# EAGLE design ESP32_4_RELAY_AND_LORA (EAGLE 9.6.2)
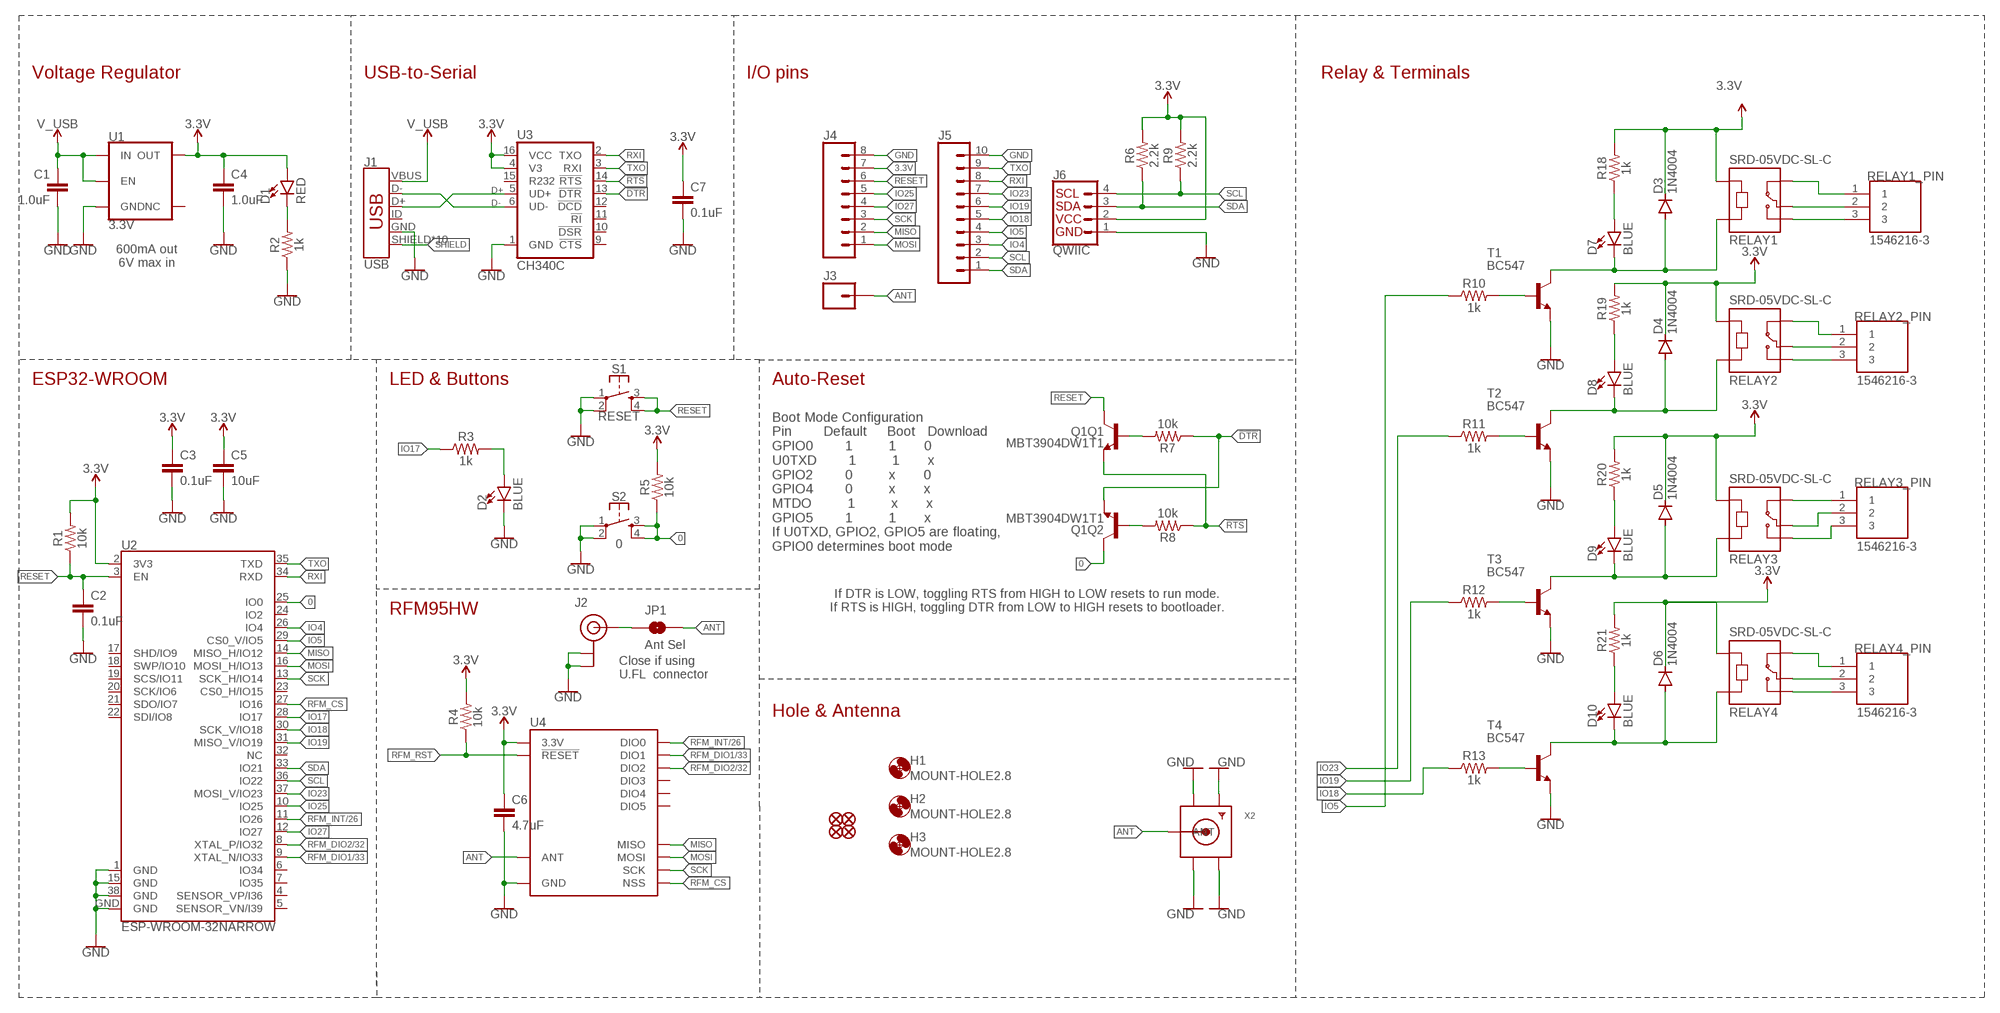
[diagram p0: schematic, sheet 1]

## Parts
C1  1.0uF  1.0UF-0603-16V-10%  [0603]
C2  0.1uF  0.1UF-0603-25V-(+80/-20%)  [0603]
C3  0.1uF  0.1UF-0603-25V-(+80/-20%)  [0603]
C4  1.0uF  1.0UF-0603-16V-10%  [0603]
C5  10uF  10UF-0603-6.3V-20%  [0603]
C6  4.7uF  4.7UF-0603-6.3V-(10%)  [0603]
C7  0.1uF  0.1UF-0603-25V-5%  [0603]
D1  RED  LED-RED0603  [LED-0603]
D2  BLUE  LED-BLUE0603  [LED-0603]
D3  1N4004  [DO41-10]
D4  1N4004  [DO41-10]
D5  1N4004  [DO41-10]
D6  1N4004  [DO41-10]
D7  BLUE  LED-BLUE0603  [LED-0603]
D8  BLUE  LED-BLUE0603  [LED-0603]
D9  BLUE  LED-BLUE0603  [LED-0603]
D10  BLUE  LED-BLUE0603  [LED-0603]
FD1  FIDUCIAL1X2  [FIDUCIAL-1X2]
FD2  FIDUCIAL1X2  [FIDUCIAL-1X2]
FD3  FIDUCIAL1X2  [FIDUCIAL-1X2]
FD4  FIDUCIAL1X2  [FIDUCIAL-1X2]
H1  MOUNT-HOLE2.8  [2,8]
H2  MOUNT-HOLE2.8  [2,8]
H3  MOUNT-HOLE2.8  [2,8]
J1  USB  USB_MICRO-B_HALF_PTH_MILL  [USB-MICROB-PTH-MILL]
J2  U.FL  [U.FL]
J3  CONN_01PTH_NO_SILK_YES_STOP  [1X01_NO_SILK]
J4  CONN_08NO_SILK_FEMALE_PTH  [1X08_NO_SILK]
J5  CONN_10NO_SILK_PTH_FEMALE  [1X10_NO_SILK]
J6  QWIIC  QWIIC_CONNECTORJS-1MM  [1X04_1MM_RA]
JP1  Ant Sel  JUMPER-SMT_2_NO_NO-SILK  [SMT-JUMPER_2_NO_NO-SILK]
Q1  MBT3904DW1T1  TRANS_NPN_DUAL-MBT3904DW1T1  [SC70-6]
R1  10k  10KOHM-0603-1/10W-1%  [0603]
R2  1k  1KOHM-0603-1/10W-1%  [0603]
R3  1k  1KOHM-0603-1/10W-1%  [0603]
R4  10k  10KOHM-0603-1/10W-1%  [0603]
R5  10k  10KOHM-0603-1/10W-1%  [0603]
R6  2.2k  2.2KOHM-0603-1/10W-1%  [0603]
R7  10k  10KOHM-0603-1/10W-1%  [0603]
R8  10k  10KOHM-0603-1/10W-1%  [0603]
R9  2.2k  2.2KOHM-0603-1/10W-1%  [0603]
R10  1k  1KOHM-0603-1/10W-1%  [0603]
R11  1k  1KOHM-0603-1/10W-1%  [0603]
R12  1k  1KOHM-0603-1/10W-1%  [0603]
R13  1k  1KOHM-0603-1/10W-1%  [0603]
R18  1k  1KOHM-0603-1/10W-1%  [0603]
R19  1k  1KOHM-0603-1/10W-1%  [0603]
R20  1k  1KOHM-0603-1/10W-1%  [0603]
R21  1k  1KOHM-0603-1/10W-1%  [0603]
RELAY1  SRD-05VDC-SL-C  [RELAY_SRD-05VDC-SL-C]
RELAY1_PIN  1546216-3  [TE_1546216-3]
RELAY2  SRD-05VDC-SL-C  [RELAY_SRD-05VDC-SL-C]
RELAY2_PIN  1546216-3  [TE_1546216-3]
RELAY3  SRD-05VDC-SL-C  [RELAY_SRD-05VDC-SL-C]
RELAY3_PIN  1546216-3  [TE_1546216-3]
RELAY4  SRD-05VDC-SL-C  [RELAY_SRD-05VDC-SL-C]
RELAY4_PIN  1546216-3  [TE_1546216-3]
S1  RESET  MOMENTARY-SWITCH-SPST-2-SMD-4.6X2.8MM  [TACTILE_SWITCH_SMD_4.6X2.8MM]
S2  0  MOMENTARY-SWITCH-SPST-2-SMD-4.6X2.8MM  [TACTILE_SWITCH_SMD_4.6X2.8MM]
T1  BC547  [TO92]
T2  BC547  [TO92]
T3  BC547  [TO92]
T4  BC547  [TO92]
U1  3.3V  V_REG_AP2112K-3.3V  [SOT23-5]
U2  ESP-WROOM-32NARROW  [ESP-WROOM-32-NARROW]
U3  CH340C  [SO016]
U4  RFM95W  [RFM95/96/97/98W]
X2  SMACONNECTOR_EDGE_UFL  [SMA_EDGELAUNCH_UFL]

## Nets
0: Q1.6(Q2:C) R5.1 S2.3 S2.4 U2.25(IO0)
3.3V: C3.1 C4.1 C5.1 C6.1 C7.1 D1.A J4.7 J6.2 R1.2 R4.2 R5.2 R6.2 R9.2 U1.5(OUT) U2.2(3V3) U3.4(V3) U3.16(VCC) U4.3.3V
!DTR: Q1.1(Q2:E) R7.1 U3.13(!DTR)
!RTS: Q1.4(Q1:E) R8.1 U3.14(!RTS)
ANT: J3.1 JP1.2 U4.ANT X2.P(ANT)
D+: J1.D+ U3.5(UD+)
D-: J1.D- U3.6(UD-)
GND: C1.2 C2.2 C3.2 C4.2 C5.2 C6.2 C7.2 D2.C J1.GND J2.1(GND) J2.2(GND) J4.8 J5.10 J6.1 R2.1 S1.1 S1.2 S2.1 S2.2 T1.1(E) T2.1(E) T3.1(E) T4.1(E) U1.2(GND) U2.1(GND) U2.15(GND) U2.38(GND) U2.GND U3.1(GND) U4.GND@1(GND) U4.GND@2(GND) U4.GND@3(GND)
GND.2: X2.GND@1(GND1) X2.GND@2(GND2) X2.GND@3(GND3) X2.GND@4(GND4) ; supply symbol labelled GND
IO4: J5.3 U2.26(IO4)
IO5: J5.4 R10.1 U2.29(CS0_V/IO5)
IO17: R3.1 U2.28(IO17)
IO18: J5.5 R13.1 U2.30(SCK_V/IO18)
IO19: J5.6 R12.1 U2.31(MISO_V/IO19)
IO23: J5.7 R11.1 U2.37(MOSI_V/IO23)
IO25: J4.5 U2.10(IO25)
IO27: J4.4 U2.12(IO27)
MISO: J4.2 U2.14(MISO_H/IO12) U4.MISO
MOSI: J4.1 U2.16(MOSI_H/IO13) U4.MOSI
N$1: D1.C R2.2
N$2: D2.A R3.2
N$3: J2.FEED(SIGNAL) JP1.1
N$4: RELAY2.NC RELAY2_PIN.1
N$5: RELAY2.COM RELAY2_PIN.2
N$6: RELAY2.NO RELAY2_PIN.3
N$7: RELAY3.NC RELAY3_PIN.1
N$8: RELAY3.COM RELAY3_PIN.2
N$9: RELAY3.NO RELAY3_PIN.3
N$10: Q1.5(Q1:B) R7.2
N$11: D3.A D7.C RELAY1.A1 T1.3(C)
N$12: Q1.2(Q2:B) R8.2
N$13: D4.A D8.C RELAY2.A1 T2.3(C)
N$14: RELAY4.NC RELAY4_PIN.1
N$15: D5.A D9.C RELAY3.A1 T3.3(C)
N$16: D7.A R18.1
N$17: R12.2 T3.2(B)
N$18: D8.A R19.1
N$19: R11.2 T2.2(B)
N$20: R10.2 T1.2(B)
N$21: D9.A R20.1
N$22: RELAY4.COM RELAY4_PIN.2
N$23: RELAY4.NO RELAY4_PIN.3
N$24: RELAY1.NC RELAY1_PIN.1
N$25: RELAY1.COM RELAY1_PIN.2
N$26: RELAY1.NO RELAY1_PIN.3
N$29: D10.A R21.1
N$30: D6.A D10.C RELAY4.A1 T4.3(C)
N$31: R13.2 T4.2(B)
N$34: D3.C R18.2 RELAY1.A2 ; supply symbol labelled 3.3V
N$35: D4.C R19.2 RELAY2.A2 ; supply symbol labelled 3.3V
N$36: D5.C R20.2 RELAY3.A2 ; supply symbol labelled 3.3V
N$37: D6.C R21.2 RELAY4.A2 ; supply symbol labelled 3.3V
RESET: C2.1 J4.6 Q1.3(Q1:C) R1.1 S1.3 S1.4 U2.3(EN)
RFM_CS: U2.27(IO16) U4.NSS
RFM_DIO1/33: U2.9(XTAL_N/IO33) U4.DIO1
RFM_DIO2/32: U2.8(XTAL_P/IO32) U4.DIO2
RFM_INT/26: U2.11(IO26) U4.DIO0
RFM_RST: R4.1 U4.!RESET
RXI: J5.8 U2.34(RXD) U3.2(TXO)
SCK: J4.3 U2.13(SCK_H/IO14) U4.SCK
SCL: J5.2 J6.4 R9.1 U2.36(IO22)
SDA: J5.1 J6.3 R6.1 U2.33(IO21)
SHIELD: J1.SHIELD J1.SHIELD2(SHIELD) J1.SHIELD3(SHIELD) J1.SHIELD4(SHIELD) J1.SHIELD5(SHIELD) J1.SHIELD6(SHIELD) J1.SHIELD7(SHIELD) J1.SHIELD8(SHIELD) J1.SHIELD9(SHIELD) J1.SHIELD10(SHIELD)
TXO: J5.9 U2.35(TXD) U3.3(RXI)
V_USB: C1.1 J1.VBUS U1.1(IN) U1.3(EN)
Unconnected: J1.ID U1.4(NC) U2.4(SENSOR_VP/I36) U2.5(SENSOR_VN/I39) U2.6(IO34) U2.7(IO35) U2.17(SHD/IO9) U2.18(SWP/IO10) U2.19(SCS/IO11) U2.20(SCK/IO6) U2.21(SDO/IO7) U2.22(SDI/IO8) U2.23(CS0_H/IO15) U2.24(IO2) U2.32(NC) U3.9(!CTS) U3.10(!DSR) U3.11(!RI) U3.12(!DCD) U3.15(R232) U4.DIO3 U4.DIO4 U4.DIO5

## Notes on the sheet
- Voltage Regulator | USB-to-Serial | I/O pins | Relay & Terminals
- 600mA out
  6V max in
- ESP32-WROOM | LED & Buttons | Auto-Reset
- Boot Mode Configuration
  Pin        Default     Boot   Download
  GPIO0        1         1       0
  U0TXD        1         1       x
  GPIO2        0         x       0
  GPIO4        0         x       x
  MTDO         1         x       x
  GPIO5        1         1       x
  If U0TXD, GPIO2, GPIO5 are floating, 
  GPIO0 determines boot mode
- If DTR is LOW, toggling RTS from HIGH to LOW resets to run mode.
  If RTS is HIGH, toggling DTR from LOW to HIGH resets to bootloader.
- RFM95HW
- Close if using
  U.FL  connector
- Hole & Antenna

## Library data of the parts
C1 C4 = SparkFun-Capacitors:1.0UF: 1µF ceramic capacitors A capacitor is a passive two-terminal electrical component used to store electrical energy temporarily in an electric field.; PROD_ID: CAP-00868
C2 C3 = SparkFun-Capacitors:0.1UF: 0.1µF ceramic capacitors A capacitor is a passive two-terminal electrical component used to store electrical energy temporarily in an electric field.; PROD_ID: CAP-00810
C5 = SparkFun-Capacitors:10UF: 10.0µF ceramic capacitors A capacitor is a passive two-terminal electrical component used to store electrical energy temporarily in an electric field.; PROD_ID: CAP-11015
C6 = SparkFun-Capacitors:4.7UF: 4.7µF ceramic capacitors A capacitor is a passive two-terminal electrical component used to store electrical energy temporarily in an electric field.; PROD_ID: CAP-08280
C7 = SparkFun-Capacitors:0.1UF: 0.1µF ceramic capacitors A capacitor is a passive two-terminal electrical component used to store electrical energy temporarily in an electric field.; PROD_ID: CAP-08604
D1 = SparkFun-LED:LED-RED: Red SMD LED Used in manufacturing of most products at SparkFun Packages: 0603 - SMD 0603 package [Product Link] <http://docs.avagotech.com/docs/AV02-0551EN> 0603 SMART - SMD 0603 SMART package ( more efficient and expensive)[Product Link] <http://www.osram-os.com/Graphics/XPic2/00077099_0.pdf> 1206 - SMD1206 package [Product Link] <https://www.sparkfun.com/datasheets/DevTools/LilyPad/Q150OVS4.pdff> SparkFun Products: Pro Mini 328 -5V <https://www.sparkfun.com/products/821> RedBoard <https://www.sparkfun.com/products/12757> IOIO-OTG <https://www.sparkfun.com/products/13613>; PROD_ID: DIO-00819
D2 D7-D10 = SparkFun-LED:LED-BLUE: Blue SMD LED Used in manufacturing of various products at SparkFun Packages: 0603 - SMD 0603 package [Product Link] <http://www.digikey.com/product-detail/en/SMLE12BC7TT86/511-1589-2-ND/1641808> 1206 - SMD1206 package [Product Link] <http://www.digikey.com/product-detail/en/lite-on-inc/LTST-C150TBKT/160-1643-1-ND/573584> SparkFun Products: ESP8266 Thing-Dev Board <https://www.sparkfun.com/products/13711> RedBoard <https://www.sparkfun.com/products/12757>; PROD_ID: DIO-08575
D3-D6 = diode:1N4004: DIODE general purpose rectifier, 1 A
FD1-FD4 = SparkFun-Aesthetics:FIDUCIAL: Fiducial Alignment Points Point-of-reference for pick-and-place machines and other optical instruments.
H1-H3 = holes:MOUNT-HOLE: MOUNTING HOLE with drill center marker
J1 = SparkFun-Connectors:USB_MICRO-B: USB Type Micro-B Connector Male/female and PTH/SMT variants SparkFun Products: SparkFun microB USB Breakout <https://www.sparkfun.com/products/12035> SparkFun USB microB Plug Breakout <https://www.sparkfun.com/products/10031> SparkFun ESP8266 Thing <https://www.sparkfun.com/products/13231>; PROD_ID: CONN-13711
J2 = SparkFun-Connectors:U.FL: SMD Antenna Connector - U.FL 2mm height, 3.0mm x 3.0mm receptacle size. SparkFun Products: SparkFun WiFi Shield - ESP8266 <https://www.sparkfun.com/products/13287> SparkFun ESP8266 Thing <https://www.sparkfun.com/products/13231> SparkFun MiniGen - Pro Mini Signal Generator Shield <https://www.sparkfun.com/products/11420>; PROD_ID: CONN-09193; SF_ID: WRL-09144
J3 = SparkFun-Connectors:CONN_01: Single connection point. Often used as Generic Header-pin footprint for 0.1 inch spaced/style header connections On any of the 0.1 inch spaced packages, you can populate with these: Break Away Headers - Straight <https://www.sparkfun.com/products/116> (PRT-00116) Break Away Male Headers - Right Angle <https://www.sparkfun.com/products/553> (PRT-00553) Female Headers <https://www.sparkfun.com/products/115> (PRT-00115) Break Away Headers - Machine Pin <https://www.sparkfun.com/products/117> (PRT-00117) Break Away Female Headers - Swiss Machine Pin <https://www.sparkfun.com/products/743> (PRT-00743) This device is also useful as a general connection point to wire up your design to another part of your project. Our various solder wires solder well into these plated through hole pads. Hook-Up Wire - Assortment (Stranded, 22 AWG) <https://www.sparkfun.com/products/11375> (PRT-11375) Hook-Up Wire - Assortment (Solid Core, 22 AWG) <https://www.sparkfun.com/products/11367> (PRT-11367) View the entire wire category on our website here <https://www.sparkfun.com/categories/141> Special notes: SMTSO-256-ET is a "flush mount" nut for a 4-40 screw. We mostly use this on specialty testbeds; it is a nice way to connect hardware to your PCB at an adjustable hieght. Also note, the SNAP packages are for using a snappable style connector. We sell a baggie of snaps and they are also used on two LilyPad designs: Snap Assortment - 30 pack (male and female) <https://www.sparkfun.com/products/11347> (DEV-11347) LilyPad Arduino SimpleSnap <https://www.sparkfun.com/products/10941> (DEV-10941) LilyPad SimpleSnap Protoboard <https://www.sparkfun.com/products/10940> (DEV-10940)
J4 = SparkFun-Connectors:CONN_08: Multi connection point. Often used as Generic Header-pin footprint for 0.1 inch spaced/style header connections On any of the 0.1 inch spaced packages, you can populate with these: Break Away Headers - Straight <https://www.sparkfun.com/products/116> (PRT-00116) Break Away Male Headers - Right Angle <https://www.sparkfun.com/products/553> (PRT-00553) Female Headers <https://www.sparkfun.com/products/115> (PRT-00115) Break Away Headers - Machine Pin <https://www.sparkfun.com/products/117> (PRT-00117) Break Away Female Headers - Swiss Machine Pin <https://www.sparkfun.com/products/743> (PRT-00743) Arduino Stackable Header - 8 Pin <https://www.sparkfun.com/products/9279> (PRT-09279) For SCREWTERMINALS and SPRING TERMINALS visit here: Screw Terimnals on SparkFun.com <https://www.sparkfun.com/search/results?term=Screw+Terminals> (5mm/3.5mm/2.54mm spacing) This device is also useful as a general connection point to wire up your design to another part of your project. Our various solder wires solder well into these plated through hole pads. Hook-Up Wire - Assortment (Stranded, 22 AWG) <https://www.sparkfun.com/products/11375> (PRT-11375) Hook-Up Wire - Assortment (Solid Core, 22 AWG) <https://www.sparkfun.com/products/11367> (PRT-11367) View the entire wire category on our website here <https://www.sparkfun.com/categories/141> Special notes: Molex polarized connector foot print use with SKU : PRT-08231 with associated crimp pins and housings. 1MM SMD Version SKU: PRT-10208 NOTES ON THE VARIANTS LOCK and LOCK_LONGPADS... This footprint was designed to help hold the alignment of a through-hole component (i.e. 6-pin header) while soldering it into place. You may notice that each hole has been shifted either up or down by 0.005 of an inch from it's more standard position (which is a perfectly straight line). This slight alteration caused the pins (the squares in the middle) to touch the edges of the holes. Because they are alternating, it causes a "brace" to hold the component in place. 0.005 has proven to be the perfect amount of "off-center" position when using our standard breakaway headers. Although looks a little odd when you look at the bare footprint, once you have a header in there, the alteration is very hard to notice. Also,if you push a header all the way into place, it is covered up entirely on the bottom side.; PROD_ID: CONN-08438
J5 = SparkFun-Connectors:CONN_10: Multi connection point. Often used as Generic Header-pin footprint for 0.1 inch spaced/style header connections On any of the 0.1 inch spaced packages, you can populate with these: Break Away Headers - Straight <https://www.sparkfun.com/products/116> (PRT-00116) Break Away Male Headers - Right Angle <https://www.sparkfun.com/products/553> (PRT-00553) Female Headers <https://www.sparkfun.com/products/115> (PRT-00115) Break Away Headers - Machine Pin <https://www.sparkfun.com/products/117> (PRT-00117) Break Away Female Headers - Swiss Machine Pin <https://www.sparkfun.com/products/743> (PRT-00743) Arduino Stackable Header - 10 Pin <https://www.sparkfun.com/products/11376> (PRT-11376) For SCREWTERMINALS and SPRING TERMINALS visit here: Screw Terimnals on SparkFun.com <https://www.sparkfun.com/search/results?term=Screw+Terminals> (5mm/3.5mm/2.54mm spacing) This device is also useful as a general connection point to wire up your design to another part of your project. Our various solder wires solder well into these plated through hole pads. Hook-Up Wire - Assortment (Stranded, 22 AWG) <https://www.sparkfun.com/products/11375> (PRT-11375) Hook-Up Wire - Assortment (Solid Core, 22 AWG) <https://www.sparkfun.com/products/11367> (PRT-11367) View the entire wire category on our website here <https://www.sparkfun.com/categories/141> Special notes: Molex polarized connector foot print use with SKU : PRT-08231 with associated crimp pins and housings. 1MM SMD Version SKU: PRT-10208 NOTES ON THE VARIANTS LOCK and LOCK_LONGPADS... This footprint was designed to help hold the alignment of a through-hole component (i.e. 6-pin header) while soldering it into place. You may notice that each hole has been shifted either up or down by 0.005 of an inch from it's more standard position (which is a perfectly straight line). This slight alteration caused the pins (the squares in the middle) to touch the edges of the holes. Because they are alternating, it causes a "brace" to hold the component in place. 0.005 has proven to be the perfect amount of "off-center" position when using our standard breakaway headers. Although looks a little odd when you look at the bare footprint, once you have a header in there, the alteration is very hard to notice. Also,if you push a header all the way into place, it is covered up entirely on the bottom side.; PROD_ID: CONN-11563
J6 = SparkFun-Connectors:QWIIC_CONNECTOR: SparkFun I2C Standard Qwiic Connector An SMD 1mm pitch JST connector makes it easy and quick (get it? Qwiic?) to connect I2C devices to each other. The Qwiic system <http://www.sparkfun.com/qwiic> enables fast and solderless connection between popular platforms and various sensors and actuators. We carry 200mm <https://www.sparkfun.com/products/14204>, 100mm <https://www.sparkfun.com/products/14205>, 50mm <https://www.sparkfun.com/products/14206>, and breadboard friendly <https://www.sparkfun.com/products/14207> Qwiic cables. We also offer 10 pcs strips <https://www.sparkfun.com/products/14323> the SMD connectors.; PROD_ID: CONN-13694
JP1 = SparkFun-Jumpers:JUMPER-SMT_2_NO: Normally open jumper This jumper has two pads in close proximity to each other. Apply solder to close the connection. Round pads are easier to solder for beginners, but are a lot larger. SparkFun Product that uses the round pads: SparkFun EL Sequencer <https://www.sparkfun.com/products/12781>
Q1 = SparkFun-DiscreteSemi:TRANS_NPN_DUAL: Dual NPN Transistors in Single Package The MBT3904W1 puts two general purpose 3904 NPN transistors in a single package. Datasheet <http://www.onsemi.com/pub_link/Collateral/MBT3904DW1T1-D.PDF> SparkFun Products: SparkFun ESP32 Thing <https://www.sparkfun.com/products/13907>; PROD_ID: TRANS-13337
R1 R4 R5 R7 R8 = SparkFun-Resistors:10KOHM: 10kΩ resistor A resistor is a passive two-terminal electrical component that implements electrical resistance as a circuit element. Resistors act to reduce current flow, and, at the same time, act to lower voltage levels within circuits. - Wikipedia; PROD_ID: RES-00824
R2 R3 R10-R13 R18-R21 = SparkFun-Resistors:1KOHM: 1kΩ resistor A resistor is a passive two-terminal electrical component that implements electrical resistance as a circuit element. Resistors act to reduce current flow, and, at the same time, act to lower voltage levels within circuits. - Wikipedia; PROD_ID: RES-07856
R6 R9 = SparkFun-Resistors:2.2KOHM: 2.2kΩ resistor A resistor is a passive two-terminal electrical component that implements electrical resistance as a circuit element. Resistors act to reduce current flow, and, at the same time, act to lower voltage levels within circuits. - Wikipedia; PROD_ID: RES-08272
RELAY1-RELAY4 = SRD-05VDC-SL-C:SRD-05VDC-SL-C: 5V Trigger Relay Module For Arduino And Raspberry Pi 5V Trigger Relay Module For Arduino And Raspberry Pi Check availability <https://pricing.snapeda.com/parts/SRD-05VDC-SL-C/Songle%20Relay/view-part?ref=eda>; AVAILABILITY: In Stock; DESCRIPTION: 5V Trigger Relay Module For Arduino And Raspberry Pi 5V Trigger Relay Module For Arduino And Raspberry Pi; MF: Songle Relay; MP: SRD-05VDC-SL-C; PACKAGE: None; PRICE: None
RELAY1_PIN RELAY2_PIN RELAY3_PIN RELAY4_PIN = Terminal-1546216-3:1546216-3: Check availability <https://pricing.snapeda.com/parts/1546216-3/TE%20Connectivity/view-part?ref=eda>; AVAILABILITY: In Stock; COMMENT: 1546216-3; DESCRIPTION: 3 Position Wire to Board Terminal Block Horizontal with Board 0.197 (5.00mm) Through Hole; MF: TE Connectivity; MP: 1546216-3; PACKAGE: None; PRICE: None; PURCHASE-URL: https://pricing.snapeda.com/search/part/1546216-3/?ref=eda
S1 S2 = SparkFun-Switches:MOMENTARY-SWITCH-SPST-2: Momentary Switch (Pushbutton) - SPST - Two Circuits Normally-open (NO) SPST momentary switches (buttons, pushbuttons). Schematic symbol includes two switch circuits. Variants SMD-4.6MMX2.8MM - 4.60mm x 2.80mm Tactile Momentary Button Switch - Used on SparkFun SAMD21 Mini Breakout <https://www.sparkfun.com/products/13664> SMD-5.2MM - Mini Pushbutton Switch - SMD <https://www.sparkfun.com/products/8720> - Used on Arduino Pro Mini <https://www.sparkfun.com/products/11114>; PROD_ID: SWCH-13065
T1-T4 = transistor:BC547: NPN TRANSISTOR
U1 = SparkFun-IC-Power:V_REG_AP2112: AP2112 - 600mA CMOS LDO Regulator w/ Enable The AP2112 is CMOS process low dropout linear regulator with enable function, the regulator delivers a guaranteed 600mA (min.) continuous load current. Features Output Voltage Accuracy: ±1.5% Output Current: 600mA (Min.) Foldback Short Current Protection: 50mA Enable Function to Turn ON/OFF VOUT Low Dropout Voltage (3.3V): 250mV (Typ.) @IOUT=600mA Excellent Load Regulation: 0.2%/A (Typ.) Excellent Line Regulation: 0.02%/V (Typ.) Low Quiescent Current: 55μA (Typ.) Low Standby Current: 0.01μA (Typ.) Low Output Noise: 50μVRMS PSRR: 100Hz -65dB, 1kHz -65dB OTSD Protection Stable with 1.0μF Flexible Cap: Ceramic, Tantalum and Aluminum Electrolytic Operation Temperature Range: -40°C to 85°C ESD: MM 400V, HBM 4000V; PROD_ID: VREG-12457
U2 = SparkFun-RF:ESP-WROOM-32; PROD_ID: IC-13849
U3 = SparkFun-IC-Comms:CH340C; PROD_ID: IC-14038
U4 = SparkFun-RF:RFM95W: RFM95/96/97/98 The RFM95/96/97/98(W) transceivers feature the LoRaTM long range modem that provides ultra-long range spread spectrum communication and high interference immunity whilst minimising current consumption. These devices also support high performance (G)FSK modes for systems including WMBus, IEEE802.15.4g. The RFM95/96/97/98(W) deliver exceptional phase noise, selectivity, receiver linearity and IIP3 for significantly lower current consumption than competing devices Datasheet <http://www.hoperf.com/upload/rf/RFM95_96_97_98W.pdf>; PROD_ID: IC-13959
X2 = adafruit:SMACONNECTOR: SMA Connector 90° DIP SMA Connector, 50 Ohm (4UConnector: 07259)

## Net classes
0 default: width 0.152 mm, drill 0.305 mm
1 power: width 0.178 mm

## Board
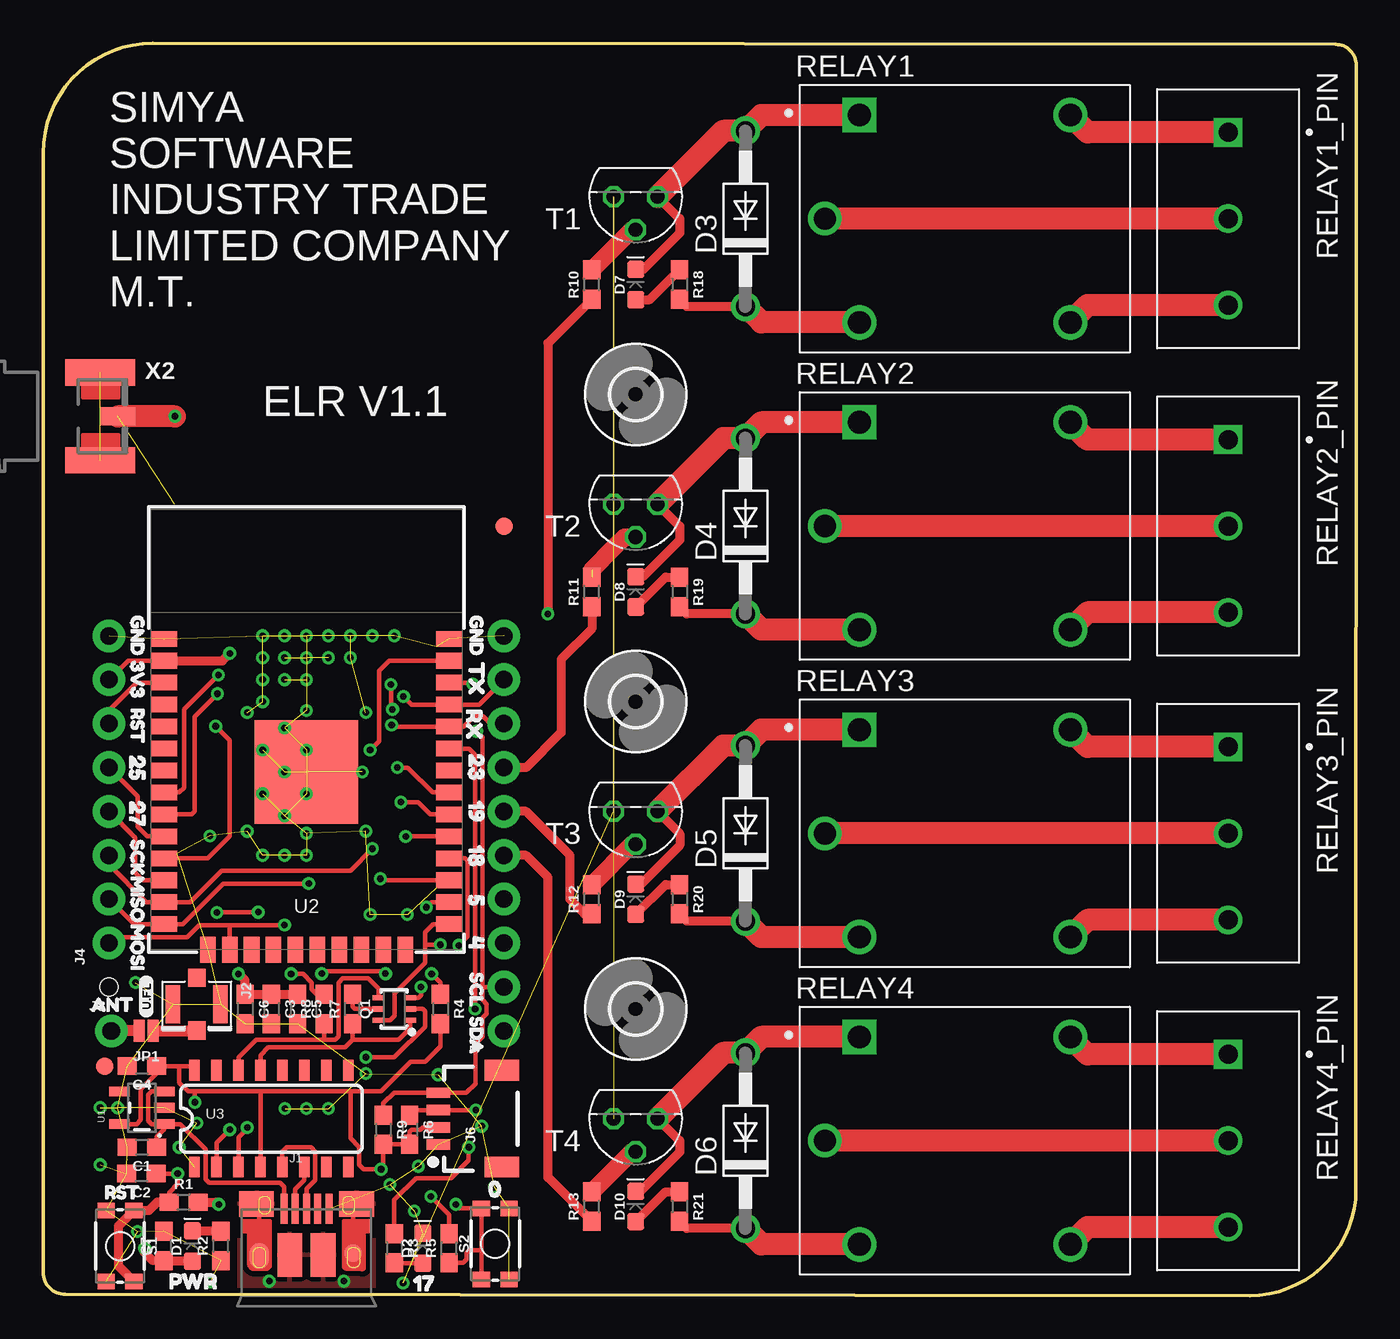
[diagram p1: board, top side]
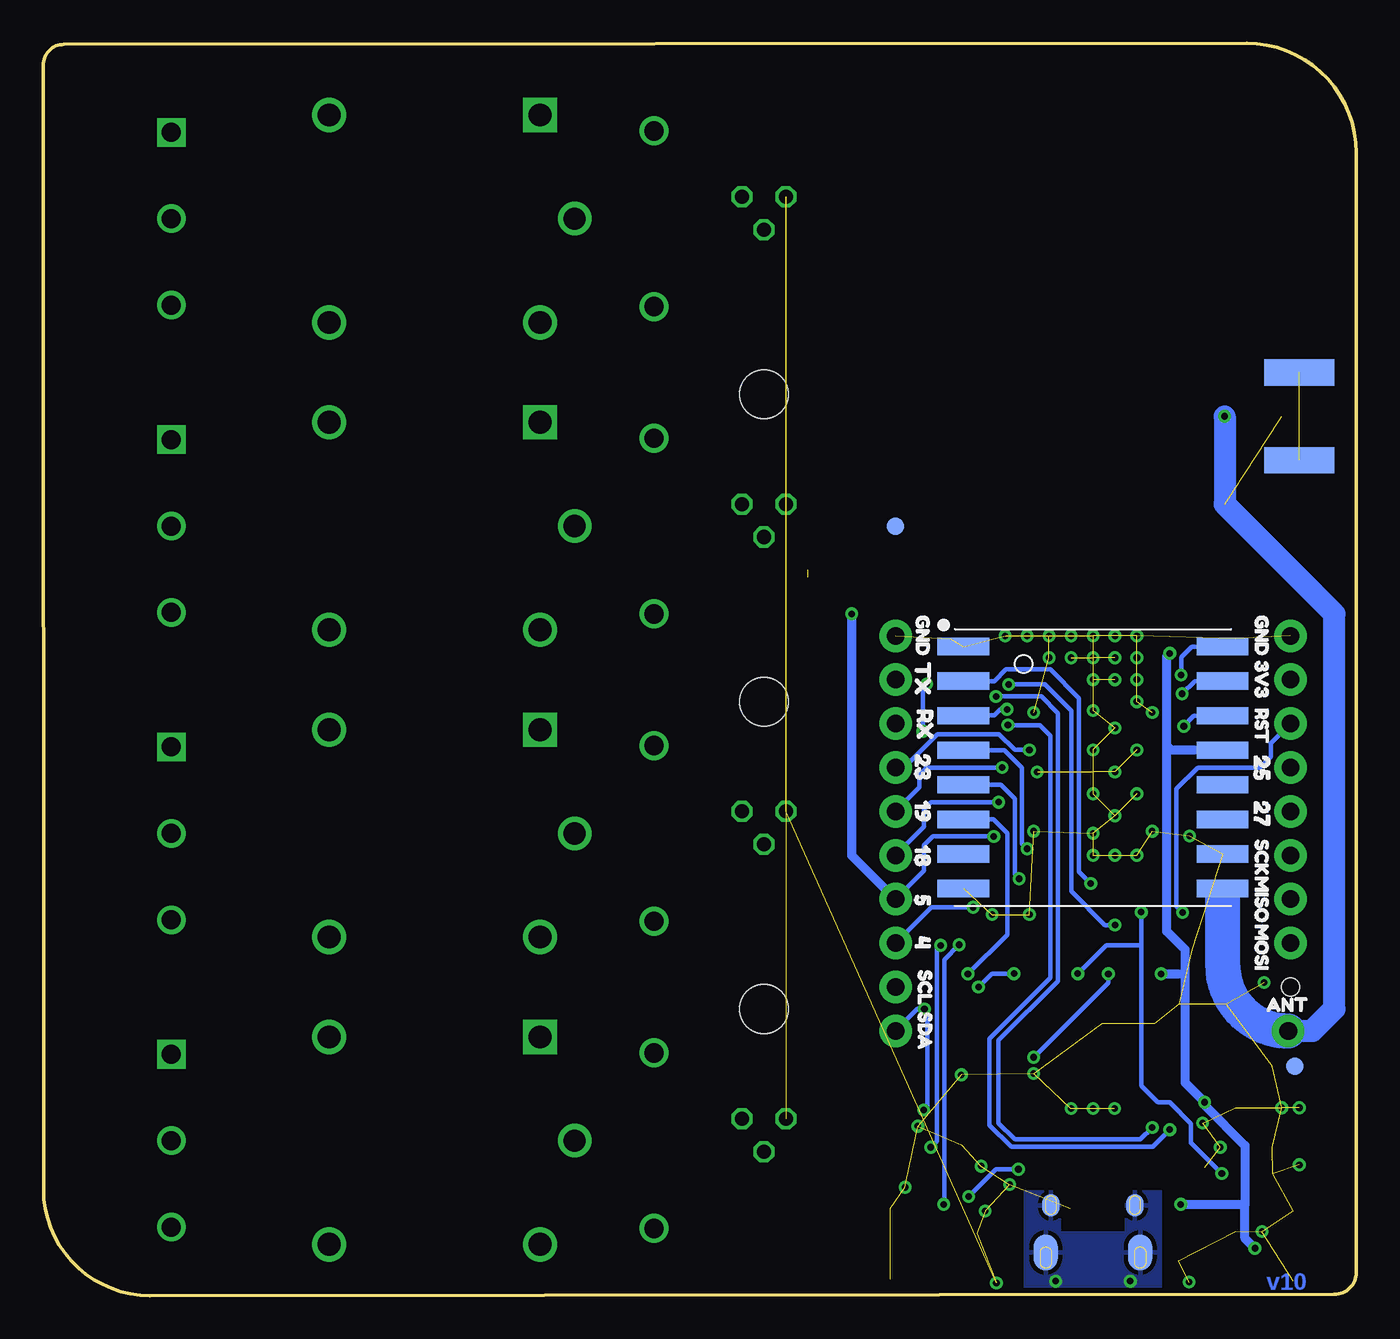
[diagram p2: board, bottom side, seen from below]

Size 76 x 72.45 mm. Coordinates in mm from the lower left corner, seen from the top.
Outline: 0,66.11 0,1.34 arc90 1.27,0.07 69.82,0 arc90 75.98,6.15 76,71.19 arc90 74.8,72.39 6.35,72.45 arc90 0,66.11
Copper layers (1*16): Top 0.035mm / dielectric 1.5mm / Bottom 0.035mm
Design rules "SparkFun-2-layer-TIGHT": minimum track width 7mil, minimum drill 15mil, track to track 7mil, track to pad 7mil, pad to pad 7mil, via to via 7mil, smd to smd 7mil, copper to edge 7mil, drill to drill 7mil, minimum pad ring 7mil, minimum via ring 7mil, stop-mask expansion 4mil, vias tented up to drill 25mil, thermal gap 10mil
Holes 1.02 mm at 3.81,17.85

### Footprints (pad centres in the part's own frame; a part is rotated, then mirrored left to right if it is on the bottom)
0603 = smd 1.1 x 1: 1 -0.85,0; 2 0.85,0
LED-0603 = smd 1 x 1: A -0.877,0; C 0.877,0
DO41-10 = drill 1.118: A 5.08,0; C -5.08,0
FIDUCIAL-1X2 = smd 1 x 1: 1 0,0
2,8 = hole 2.8: 0,0
USB-MICROB-PTH-MILL = smd 0.4 x 1.75: D+ 0,0; D- -0.65,0; GND 1.3,0; ID 0.65,0; VBUS -1.3,0 | smd 2 x 1.46: SHIELD -2.9,0.275; SHIELD2 2.9,0.275 | smd 1.425 x 2.5: SHIELD3 -0.963,-2.675; SHIELD4 0.963,-2.675 | smd 1.4 x 2.1 bottom: SHIELD5 -2.731,-2.531; SHIELD7 2.729,-2.531 | smd 1 x 1: SHIELD6 2.7,-2.575 | smd 1.1 x 1.5: SHIELD8 -2.731,-2.731 | smd 1 x 1.3 bottom: SHIELD9 -2.43,0.195; SHIELD10 2.43,0.195
U.FL = smd 2.2 x 0.85: 1 0,1.375; 2 0,-1.375 | smd 1.05 x 1: FEED 1.525,0; NC -1.525,0
1X01_NO_SILK = drill 1.016 pad 1.88: 1 0,0
1X08_NO_SILK = drill 1.016 pad 1.88: 1 0,0; 2 2.54,0; 3 5.08,0; 4 7.62,0; 5 10.16,0; 6 12.7,0; 7 15.24,0; 8 17.78,0
1X10_NO_SILK = drill 1.016 pad 1.88: 1 0,0; 2 2.54,0; 3 5.08,0; 4 7.62,0; 5 10.16,0; 6 12.7,0; 7 15.24,0; 8 17.78,0; 9 20.32,0; 10 22.86,0
1X04_1MM_RA = smd 0.6 x 1.35: 1 -1.5,0; 2 -0.5,0; 3 0.5,0; 4 1.5,0 | smd 1.2 x 2: NC1 2.8,-3.675; NC2 -2.8,-3.675
SMT-JUMPER_2_NO_NO-SILK = smd 0.635 x 1.27: 1 -0.406,0; 2 0.406,0
SC70-6 = smd 0.3 x 0.66: 1 -0.65,-0.92; 2 0,-0.92; 3 0.65,-0.92; 4 0.65,0.92; 5 0,0.92; 6 -0.65,0.92
RELAY_SRD-05VDC-SL-C = drill 1.32 square: A1 -6.1,6 | drill 1.32: A2 -6.1,-6; NC 6.1,6; NO 6.1,-6 | drill 1.29: COM -8.1,0
TE_1546216-3 = drill 1.1 square: 1 -5,0 | drill 1.1: 2 0,0; 3 5,0
TACTILE_SWITCH_SMD_4.6X2.8MM = smd 0.9 x 1: 1 -2.05,-0.8; 2 2.05,-0.8; 3 2.05,0.8; 4 -2.05,0.8
TO92 = drill 0.813 octagon: 1 1.27,0; 2 0,1.905; 3 -1.27,0
SOT23-5 = smd 0.55 x 1.2: 1 -0.95,-1.3; 2 0,-1.3; 3 0.95,-1.3; 4 0.95,1.3; 5 -0.95,1.3
ESP-WROOM-32-NARROW = smd 0.9 x 1.5: 1 6.43,8.238; 2 5.16,8.238; 3 3.89,8.238; 4 2.62,8.238; 5 1.35,8.238; 6 0.08,8.238; 7 -1.19,8.238; 8 -2.46,8.238; 9 -3.73,8.238; 10 -5,8.238; 11 -6.27,8.238; 12 -7.54,8.238; 13 -8.81,8.238; 14 -10.08,8.238; 25 -10.08,-8.238; 26 -8.81,-8.238; 27 -7.54,-8.238; 28 -6.27,-8.238; 29 -5,-8.238; 30 -3.73,-8.238; 31 -2.46,-8.238; 32 -1.19,-8.238; 33 0.08,-8.238; 34 1.35,-8.238; 35 2.62,-8.238; 36 3.89,-8.238; 37 5.16,-8.238; 38 6.43,-8.238 | smd 1.5 x 0.9: 15 -11.57,5.715; 16 -11.57,4.445; 17 -11.57,3.175; 18 -11.57,1.905; 19 -11.57,0.635; 20 -11.57,-0.635; 21 -11.57,-1.905; 22 -11.57,-3.175; 23 -11.57,-4.445; 24 -11.57,-5.715 | smd 6 x 6: GND -1.27,0
SO016 = smd 0.6 x 1.2: 1 -4.445,-2.8; 2 -3.175,-2.8; 3 -1.905,-2.8; 4 -0.635,-2.8; 5 0.635,-2.8; 6 1.905,-2.8; 7 3.175,-2.8; 8 4.445,-2.8; 9 4.445,2.8; 10 3.175,2.8; 11 1.905,2.8; 12 0.635,2.8; 13 -0.635,2.8; 14 -1.905,2.8; 15 -3.175,2.8; 16 -4.445,2.8
RFM95/96/97/98W = smd 3 x 1: 3.3V 7.5,1; !RESET -7.5,-3; ANT 7.5,-7; DIO0 7.5,3; DIO1 7.5,5; DIO2 7.5,7; DIO3 7.5,-3; DIO4 7.5,-1; DIO5 -7.5,-5; GND@1 -7.5,7; GND@2 -7.5,-7; GND@3 7.5,-5; MISO -7.5,5; MOSI -7.5,3; NSS -7.5,-1; SCK -7.5,1
SMA_EDGELAUNCH_UFL = smd 4.064 x 1.524: GND@1 2.032,-2.54; GND@2 2.032,2.54 | smd 4.064 x 1.524 bottom: GND@3 2.032,2.54; GND@4 2.032,-2.54 | smd 2.032 x 1.016: P 3.048,0

### Placement (x,y rotation side)
C1  5.71,8.58 180 top
C2  5.69,7.06 180 top
C3  13.21,16.58 270 top
C4  5.71,13.28 180 top
C5  14.73,16.58 270 top
C6  11.68,16.58 270 top
C7  6.99,2.86 90 top
D1  8.64,2.86 90 top
D2  21.97,2.74 90 top
D3  40.64,62.3 90 top
D4  40.64,44.52 90 top
D5  40.64,26.74 90 top
D6  40.64,8.96 90 top
D7  34.29,58.49 90 top
D8  34.29,40.71 90 top
D9  34.29,22.93 90 top
D10  34.29,5.15 90 top
FD1  26.67,44.52 0 bottom
FD2  3.56,13.28 0 top
FD3  26.67,44.52 0 top
FD4  3.56,13.28 0 bottom
H1  34.29,34.36 270 top
H2  34.29,52.14 270 top
H3  34.29,16.58 270 top
J1  15.24,5.02 0 top
J2  8.89,16.86 270 top
J3  3.94,15.31 0 top
J4  3.81,20.39 90 top
J5  26.67,15.31 90 top
J6  22.86,10.23 90 top
JP1  5.97,15.31 180 top
Q1  20.32,16.58 90 top
R1  8.13,5.4 0 top
R2  10.29,2.86 90 top
R3  20.32,2.74 270 top
R4  22.99,16.58 270 top
R5  23.49,2.74 90 top
R6  21.21,9.6 270 top
R7  17.91,16.58 90 top
R8  16.26,16.58 90 top
R9  19.68,9.6 270 top
R10  31.75,58.49 90 top
R11  31.75,40.71 90 top
R12  31.75,22.93 90 top
R13  31.75,5.15 90 top
R18  36.83,58.49 270 top
R19  36.83,40.71 270 top
R20  36.83,22.93 270 top
R21  36.83,5.15 270 top
RELAY1  53.34,62.3 0 top
RELAY1_PIN  68.58,62.3 270 top
RELAY2  53.34,44.52 0 top
RELAY2_PIN  68.58,44.52 270 top
RELAY3  53.34,26.74 0 top
RELAY3_PIN  68.58,26.74 270 top
RELAY4  53.34,8.96 0 top
RELAY4_PIN  68.58,8.96 270 top
S1  4.45,2.86 270 top
S2  26.16,2.99 90 top
T1  34.29,63.57 180 top
T2  34.29,45.79 180 top
T3  34.29,28.01 180 top
T4  34.29,10.23 180 top
U1  5.71,10.87 90 top
U2  15.24,31.57 90 top
U3  13.21,10.23 0 top
U4  15.24,30.55 0 bottom
U$1  [GND0]  5.46,40.01 270 top
U$2  [3V31]  5.46,37.41 270 top
U$3  [RST2]  5.46,34.68 270 top
U$4  [2517]  5.46,32.07 270 top
U$5  [279]  5.46,29.41 270 top
U$6  [SCK3]  5.46,27.06 270 top
U$7  [MISO4]  5.46,24.96 270 top
U$8  [MOSI5]  5.46,22.17 270 top
U$9  [ANT6]  2.06,16.83 0 top
U$10  [GND0]  25.08,40.01 270 top
U$11  [TX16]  25.08,37.41 270 top
U$12  [RX15]  24.96,34.74 270 top
U$13  [2314]  25.08,32.14 270 top
U$14  [1912]  25.08,29.41 270 top
U$15  [1811]  25.08,26.87 270 top
U$16  [513]  25.08,24.01 270 top
U$17  [410]  25.08,21.6 270 top
U$18  [SCL8]  25.08,19.37 270 top
U$19  [SDA7]  25.08,16.83 270 top
U$20  [RST2]  2.86,5.98 0 top
U$21  [020]  24.96,6.17 0 top
U$22  [PWR19]  6.48,0.83 0 top
U$23  [1722]  20.64,0.71 0 top
U$24  [U#FL0]  5.97,16.07 90 top
U$26  [GND0]  25.08,40.01 270 bottom
U$27  [TX16]  25.08,37.41 270 bottom
U$28  [RX15]  24.96,34.74 270 bottom
U$29  [2314]  25.08,32.14 270 bottom
U$30  [1912]  25.08,29.41 270 bottom
U$31  [1811]  25.08,26.87 270 bottom
U$32  [513]  25.08,24.01 270 bottom
U$33  [410]  25.08,21.6 270 bottom
U$34  [SCL8]  24.96,19.5 270 bottom
U$35  [SDA7]  24.96,17.09 270 bottom
U$36  [ANT6]  5.94,16.83 0 bottom
U$37  [GND0]  5.46,40.01 270 bottom
U$38  [3V31]  5.46,37.41 270 bottom
U$39  [RST2]  5.46,34.68 270 bottom
U$40  [2517]  5.46,32.07 270 bottom
U$41  [279]  5.46,29.41 270 bottom
U$42  [SCK3]  5.46,27.06 270 bottom
U$43  [MISO4]  5.46,24.96 270 bottom
U$44  [MOSI5]  5.46,22.17 270 bottom
X2  1.27,50.87 0 top

### Tracks (layer width: path | path; a pad name or v marks a point on that pad's centre or on a via)
0  (via drill 0.38)
  Top 0.254: 25.36,2.61 S2.3 24.11,5.04 v23.88,5.28 | 25.36,2.61 S2.4 | R5.1 24.3,1.89 24.51,2.1 24.51,2.48 24.64,2.61 25.36,2.61 | U2.25 22.56,21.49 22.1,21.03 22.1,20.26 | 22.1,20.26 22.1,19.25 20.33,17.48 20.33,16.19 20.07,15.93 Q1.6 | 22.1,20.26 22.13,20.29 v22.99,20.29
  Bottom 0.254: v22.99,20.29 23.85,19.43 23.85,8.5 23.82,8.48 23.82,5.33 v23.88,5.28
3.3V  (via drill 0.38)
  Top 0.254: J4.7 4.91,36.73 U2.2 | R5.2 23.49,4.67 v22.44,5.73 | 8.76,11.82 8.38,11.82 7.87,12.32 7.87,13.28 | 8.76,11.82 12.57,11.82 | 12.57,11.82 17.78,11.82 | 8.76,11.82 8.76,11.2 v8.78,11.18 | U3.16 8.52,13.28 7.87,13.28 | 7.87,13.28 7.75,13.28 C4.1 6.57,12.86 5.65,11.94 5.65,10.17 5.4,9.92 U1.5 | U3.4 12.57,11.82 | 17.78,11.82 17.78,9.09 18.29,8.58 18.29,7.56 18.54,7.31 v19.56,7.31 19.68,7.44 R9.2 R6.2 21.21,9.46 21.34,9.59 21.84,9.59 21.97,9.73 J6.2 | 17.78,11.82 19.56,11.82 21.27,13.53 22.1,13.53 22.99,14.42 R4.2
  Top 0.508: v10.8,37.15 10.37,36.73 U2.2 | v11.3,18.61 11.68,18.23 C6.1 C3.1 C5.1 | R1.2 10.03,5.4 v10.16,5.28 | D1.A 7.01,1.99 C7.1 6.35,2.01 5.88,2.48 5.87,2.48 v5.87,2.74
  Bottom 0.254: v19.56,7.31 20.85,7.31 v22.44,5.73
  Bottom 0.508: v10.8,37.15 10.97,36.98 10.97,31.82 | 9.91,18.61 9.91,20.01 10.97,21.08 10.97,31.82 | v11.3,18.61 9.91,18.61 | 9.91,18.61 9.91,12.31 v8.78,11.18 8.78,11.02 6.44,8.68 6.44,7.06 6.44,5.28 | v10.16,5.28 6.44,5.28 | v5.87,2.74 6.44,3.31 6.44,5.28 | U4.3.3V 10.7,31.55 10.97,31.82
!DTR
  Top 0.254: Q1.1 21.24,15.47 20.56,14.79 17.91,14.79 | R7.1 17.91,14.79 | U3.13 12.57,13.91 13.03,14.37 17.49,14.37 17.91,14.79
!RTS
  Top 0.254: Q1.4 19.4,17.75 18.81,18.34 17.34,18.34 17.1,18.11 17.1,15.01 16.89,14.8 16.26,14.8 | R8.1 16.26,14.8 | U3.14 11.3,13.79 12.32,14.8 16.26,14.8
ANT  (via drill 0.38)  (1 unrouted)
  Top 0.635: JP1.2 J3.1
  Top 1.27: v7.62,50.87 X2.P
  Bottom 1.016: 7.74,22.93 U4.ANT | 7.74,19.24 7.74,19.11
  Bottom 1.27: J3.1 2.54,15.31 1.27,16.58 1.27,39.44 7.62,45.79 v7.62,50.87
  Bottom 2.032: 7.74,19.11 arc-90 J3.1 | 7.74,19.24 7.74,22.93
D+
  Top 0.254: J1.D+ 15.24,6.17 15.75,6.67 15.75,8.33 15.49,8.58 14.1,8.58 13.84,8.33 U3.5
D-
  Top 0.254: J1.D- 14.59,6.15 15.11,6.67 U3.6
GND  (via drill 0.38)  (86 unrouted)
  other vias: 15.24,33.85 15.24,26.74 20.32,38.17 11.81,26.87 11.81,33.73 19.05,38.17 18.67,33.73 5.46,3.7 21.48,4.9 26.11,6.27 9.65,26.59 18.47,30.3 18.67,26.87 9.68,0.78 21.72,7.49 12.7,25.47 3.3,10.87 4.32,10.87 17.78,38.17 16.51,38.17 15.24,38.17 13.97,38.17 12.7,38.17 17.78,36.9 16.51,36.9 15.24,36.9 13.97,36.9 12.7,36.9 15.24,35.63 13.97,35.63 12.7,35.63 12.7,34.36 3.3,7.56 21.08,22.04 18.92,22.04 13.97,25.47 15.24,25.47 5.33,18.1 14,10.81 15.24,10.81 16.51,10.81 20.07,6.42 18.67,12.85 22.86,12.77 20.83,0.73 25.37,9.8 7.87,8.58 13.97,32.84 15.24,31.57 12.7,31.57 13.97,30.3 15.24,29.03 12.7,29.03 13.97,27.76 8.89,9.98
GND.2  (3 unrouted)
IO4  (via drill 0.38)
  Top 0.254: U2.26 22.46,22.76 v22.17,22.47
  Bottom 0.254: J5.3 24.59,22.47 v22.17,22.47
IO5  (via drill 0.38)
  Top 0.254: U2.29 v20.98,26.57 v20.98,26.56
  Top 0.508: R10.1 29.21,55.1 v29.21,39.44
  Bottom 0.254: v20.98,26.56 24.51,26.56 25.02,26.05 25.02,24.58 J5.4
  Bottom 0.508: v29.21,39.44 29.21,25.47 J5.4
IO17  (via drill 0.38)
  Top 0.254: R3.1 20.32,5.53 21.58,6.79 23.6,6.79 24.62,7.82 v24.62,8.58 | U2.28 24.43,25.3 24.56,25.17 24.56,20.78 v24.05,20.26
  Bottom 0.254: v24.62,8.58 24.28,8.92 24.28,20.03 v24.05,20.26
IO18  (via drill 0.38)
  Top 0.254: U2.30 22.4,27.84 21.69,28.54 v20.7,28.54
  Top 0.508: R13.1 29.21,6.84 29.21,24.2 27.94,25.47 J5.5
  Bottom 0.254: v20.7,28.54 24.61,28.54 25.02,28.14 25.02,27.12 J5.5
IO19  (via drill 0.38)
  Top 0.254: U2.31 22.53,29.11 21.08,30.55 v20.5,30.55
  Top 0.508: R12.1 31.33,22.08 30.48,22.93 30.48,25.47 27.94,28.01 J5.6
  Bottom 0.254: v20.5,30.55 24.89,30.55 25.27,30.17 25.27,29.41 J5.6
IO23  (via drill 0.38)
  Top 0.254: v18.92,31.57 19.43,32.07 19.43,36.14 20.02,36.73 U2.37
  Top 0.508: R11.1 31.75,38.59 29.97,36.81 29.97,32.58 27.94,30.55 J5.7
  Bottom 0.254: v18.92,31.57 19.76,31.57 20.68,32.48 24.26,32.48 26.19,30.55 J5.7
IO25
  Top 0.254: U2.10 6.02,26.57 5.46,27.12 5.46,28.9 J4.5
IO27
  Top 0.254: U2.12 5.76,24.03 5.33,24.45 5.33,26.49 J4.4
MISO  (via drill 0.38)
  Top 0.254: J4.2 5.25,21.49 U2.14 8.08,21.49 10.43,23.83 v15.37,23.83
  Bottom 0.254: U4.MISO 20.95,35.55 20.28,36.23 17.72,36.23 16.06,34.57 16.06,24.52 v15.37,23.83
MOSI  (via drill 0.38)
  Top 0.254: 10.8,21.42 9.02,21.42 8.33,20.73 4.15,20.73 J4.1 | 10.8,21.42 13.96,21.42 v13.97,21.43 | U2.16 10.8,21.42 | v20.12,35.36 20.12,34.01 v20.22,33.92
  Bottom 0.254: v13.97,21.43 14.55,21.43 16.49,23.38 16.49,33.83 18.02,35.36 v20.12,35.36 | U4.MOSI 22.72,33.57 20.95,33.57 20.61,33.92 v20.22,33.92
N$1
  Top 0.508: R2.2 8.66,3.71 D1.C
N$2
  Top 0.254: D2.A 20.35,1.86 R3.2
N$3
  Top 0.635: JP1.1 8.87,15.31 arc90 J2.FEED
N$4
  Top 1.27: RELAY2_PIN.1 60.44,49.52 RELAY2.NC
N$5
  Top 1.27: RELAY2_PIN.2 RELAY2.COM
N$6
  Top 1.27: RELAY2_PIN.3 60.44,39.52 RELAY2.NO
N$7
  Top 1.27: RELAY3_PIN.1 60.44,31.74 RELAY3.NC
N$8
  Top 1.27: RELAY3_PIN.2 RELAY3.COM
N$9
  Top 1.27: RELAY3_PIN.3 60.44,21.74 RELAY3.NO
N$10
  Top 0.254: R7.2 17.91,16.71 18.03,16.59 18.53,16.59 18.54,16.58 Q1.5
N$11
  Top 0.508: T1.3 36.83,62.3 36.83,61.46 34.73,59.37 D7.C
  Top 1.27: RELAY1.A1 41.56,68.3 D3.A 39.37,67.38 T1.3
N$12  (via drill 0.38)
  Top 0.254: Q1.2 21.97,16.58 22.1,16.45 22.1,15.56 20.32,13.79 v18.67,13.79 | R8.2 15.83,17.43 15.54,17.72 15.54,18.11 15.03,18.61 v14.35,18.61
  Bottom 0.254: v18.67,13.79 14.35,18.1 v14.35,18.61
N$13
  Top 0.508: T2.3 36.83,44.52 36.83,43.71 34.71,41.59 D8.C
  Top 1.27: RELAY2.A1 41.56,50.52 D4.A 39.37,49.6 T2.3
N$14
  Top 1.27: RELAY4_PIN.1 60.44,13.96 RELAY4.NC
N$15
  Top 0.508: D9.C 34.61,23.81 36.85,26.05 36.85,26.72 T3.3
  Top 1.27: RELAY3.A1 41.56,32.74 D5.A 39.37,31.82 T3.3
N$16
  Top 0.508: D7.A 35.1,57.61 R18.1
N$17
  Top 1.016: T3.2 34.08,26.11 R12.2
N$18
  Top 0.508: D8.A 36.02,41.56 R19.1
N$19  (1 unrouted)
  Top 1.016: T2.2 33.66,43.89 33.02,43.25 31.75,41.98
N$20
  Top 1.016: T1.2 34.08,61.67 R10.2
N$21
  Top 0.508: D9.A 36.02,23.78 R20.1
N$22
  Top 1.27: RELAY4_PIN.2 RELAY4.COM
N$23
  Top 1.27: RELAY4_PIN.3 60.44,3.96 RELAY4.NO
N$24
  Top 1.27: RELAY1_PIN.1 60.44,67.3 RELAY1.NC
N$25
  Top 1.27: RELAY1_PIN.2 RELAY1.COM
N$26
  Top 1.27: RELAY1_PIN.3 60.44,57.3 RELAY1.NO
N$29
  Top 0.508: D10.A 36.02,6 R21.1
N$30
  Top 0.508: T4.3 36.83,8.96 36.83,8.3 36.8,8.27 34.56,6.03 D10.C
  Top 1.27: RELAY4.A1 41.56,14.96 D6.A 39.37,14.04 T4.3
N$31
  Top 1.016: T4.2 34.08,8.33 R13.2
N$34
  Top 0.508: D3.C 37.25,57.22 R18.2
  Top 1.27: RELAY1.A2 41.56,56.3 D3.C
N$35
  Top 0.508: D4.C 37.25,39.44 R19.2
  Top 1.27: RELAY2.A2 41.56,38.52 D4.C
N$36
  Top 0.508: D5.C 37.25,21.66 R20.2
  Top 1.27: RELAY3.A2 41.56,20.74 D5.C
N$37
  Top 0.508: D6.C 37.25,3.88 R21.2
  Top 1.27: RELAY4.A2 41.56,2.96 D6.C
RESET  (via drill 0.38)
  Top 0.254: U2.3 5.41,35.46 3.81,33.85 J4.6 | v12.45,22.18 10.07,22.18 v10.06,22.17 | v19.81,18.62 19.66,18.78 16.27,18.78 v16.12,18.62 | Q1.3 21.72,17.23 21.86,17.38 v21.86,17.85 | R1.1 7.28,5.95 7.79,6.46 v7.79,7.06 C2.1
  Top 0.508: S1.3 4.36,1.7 4.36,4.03 S1.4 6.11,4.91 6.6,5.4 R1.1
  Bottom 0.254: v12.45,22.18 12.45,20.26 | 12.45,20.26 12.45,12.14 11.49,11.18 10.8,11.18 9.56,9.95 9.56,8.83 v7.79,7.06 | J4.6 4.95,31.95 4.95,31.19 5.59,30.55 9.17,30.55 10.41,29.31 10.41,22.52 v10.06,22.17 | v16.12,18.62 14.48,20.26 12.45,20.26 | v21.86,17.85 21.09,18.62 v19.81,18.62
RFM_CS  (via drill 0.38)
  Top 0.254: U2.27 19.61,24.03 v19.52,24.12
  Bottom 0.254: U4.NSS 20.57,29.55 19.77,28.75 19.77,24.37 v19.52,24.12
RFM_DIO1/33  (via drill 0.38)
  Top 0.254: U2.9 8.59,27.84 8.76,28.01 8.76,33.5 v10.08,34.82
  Bottom 0.254: U4.DIO1 9.35,35.55 v10.08,34.82
RFM_DIO2/32  (via drill 0.38)
  Top 0.254: U2.8 7.87,29.11 8.15,29.38 8.15,33.92 v10.13,35.9
  Bottom 0.254: U4.DIO2 9.51,37.55 10.13,36.93 v10.13,35.9
RFM_INT/26  (via drill 0.38)
  Top 0.254: v9.98,32.94 10.8,32.13 10.8,26.57 9.53,25.3 U2.11
  Bottom 0.254: U4.DIO0 9.4,33.55 9.98,32.97 v9.98,32.94
RFM_RST  (via drill 0.38)
  Top 0.254: v22.48,18.61 22.99,18.1 R4.1
  Bottom 0.254: U4.!RESET 21,27.55 20.21,26.75 20.21,20.89 v22.48,18.61
RXI  (via drill 0.38)
  Top 0.254: v20.16,33 20.25,32.92 U2.34 24.34,32.92 24.94,33.52 25.46,33.52 25.89,33.09 J5.8 | v10.8,9.6 10.03,8.83 U3.2
  Bottom 0.254: v20.16,33 18.33,33 17.7,32.38 17.7,18.37 21.22,14.86 21.22,9.86 19.96,8.6 11.79,8.6 v10.8,9.6
SCK  (via drill 0.38)
  Top 0.254: v19.05,25.85 17.78,24.58 10.33,24.58 8.51,22.76 U2.13 5.97,22.76 3.81,24.92 J4.3
  Bottom 0.254: U4.SCK 20.36,31.55 19.34,30.54 19.34,26.14 v19.05,25.85
SCL  (via drill 0.38)
  Top 0.254: U2.36 24.78,35.46 v24.86,35.38 | v25.08,32.64 25.43,32.29 25.43,17.85 | 25.43,17.85 25.43,17.1 25.67,16.86 25.67,16.3 25.43,16.06 25.43,14.98 25.02,14.57 25.02,12.26 24.49,11.73 J6.4 20.3,11.73 19.68,11.12 R9.1 | J5.2 25.43,17.85
  Bottom 0.254: v24.86,35.38 25.08,35.16 v25.08,32.64
SDA  (via drill 0.38)
  Top 0.254: v25.03,10.73 J6.3 21.49,10.73 R6.1 | U2.33 24.64,31.65 24.99,31.29 v24.99,16.58
  Bottom 0.254: v25.03,10.73 24.83,10.93 24.83,16.42 v24.99,16.58 25.4,16.58 J5.1
SHIELD  (via drill 0.38)
  Top 0.254: J1.SHIELD6 17.94,5.1 J1.SHIELD2 | J1.SHIELD8 12.51,5.13 J1.SHIELD
  other vias: 13.08,0.83 17.4,0.83
  pour Top (isolate 0.305): 11.3,0.07 11.3,6.04 13.34,6.04 13.34,3.63 17.14,3.63 17.14,6.04 19.18,6.04 19.18,0.2 19.05,0.07
  pour Bottom (isolate 0.305): 19.18,0.07 19.18,6.04 17.14,6.04 17.14,3.63 13.34,3.63 13.34,6.04 11.3,6.04 11.3,0.07
TXO  (via drill 0.38)
  Top 0.254: v20.85,34.67 21.33,34.19 U2.35 25.23,34.19 J5.9 | U3.3 11.3,9.15 11.81,9.66 v11.81,9.72
  Bottom 0.254: v20.85,34.67 18.24,34.67 17.27,33.7 17.27,18.2 20.7,14.77 20.7,9.98 19.76,9.04 12.5,9.04 v11.81,9.72
V_USB
  Top 0.254: J1.VBUS 13.94,6.29 13.71,6.53 9.61,6.53 9.4,6.73 9.4,8.45 7.93,9.92 U1.1 | C1.1 6.57,9.18 7.01,9.63 U1.1 | U1.3 6.28,11.82 6.08,11.61 6.08,10.12 6.28,9.92 U1.1

### Text on the board
Bottom: v10
tNames: SIMYA / SOFTWARE / INDUSTRY TRADE / LIMITED COMPANY / M.T. | ELR V1.1